# EAGLE design aspirin (EAGLE 6.1)
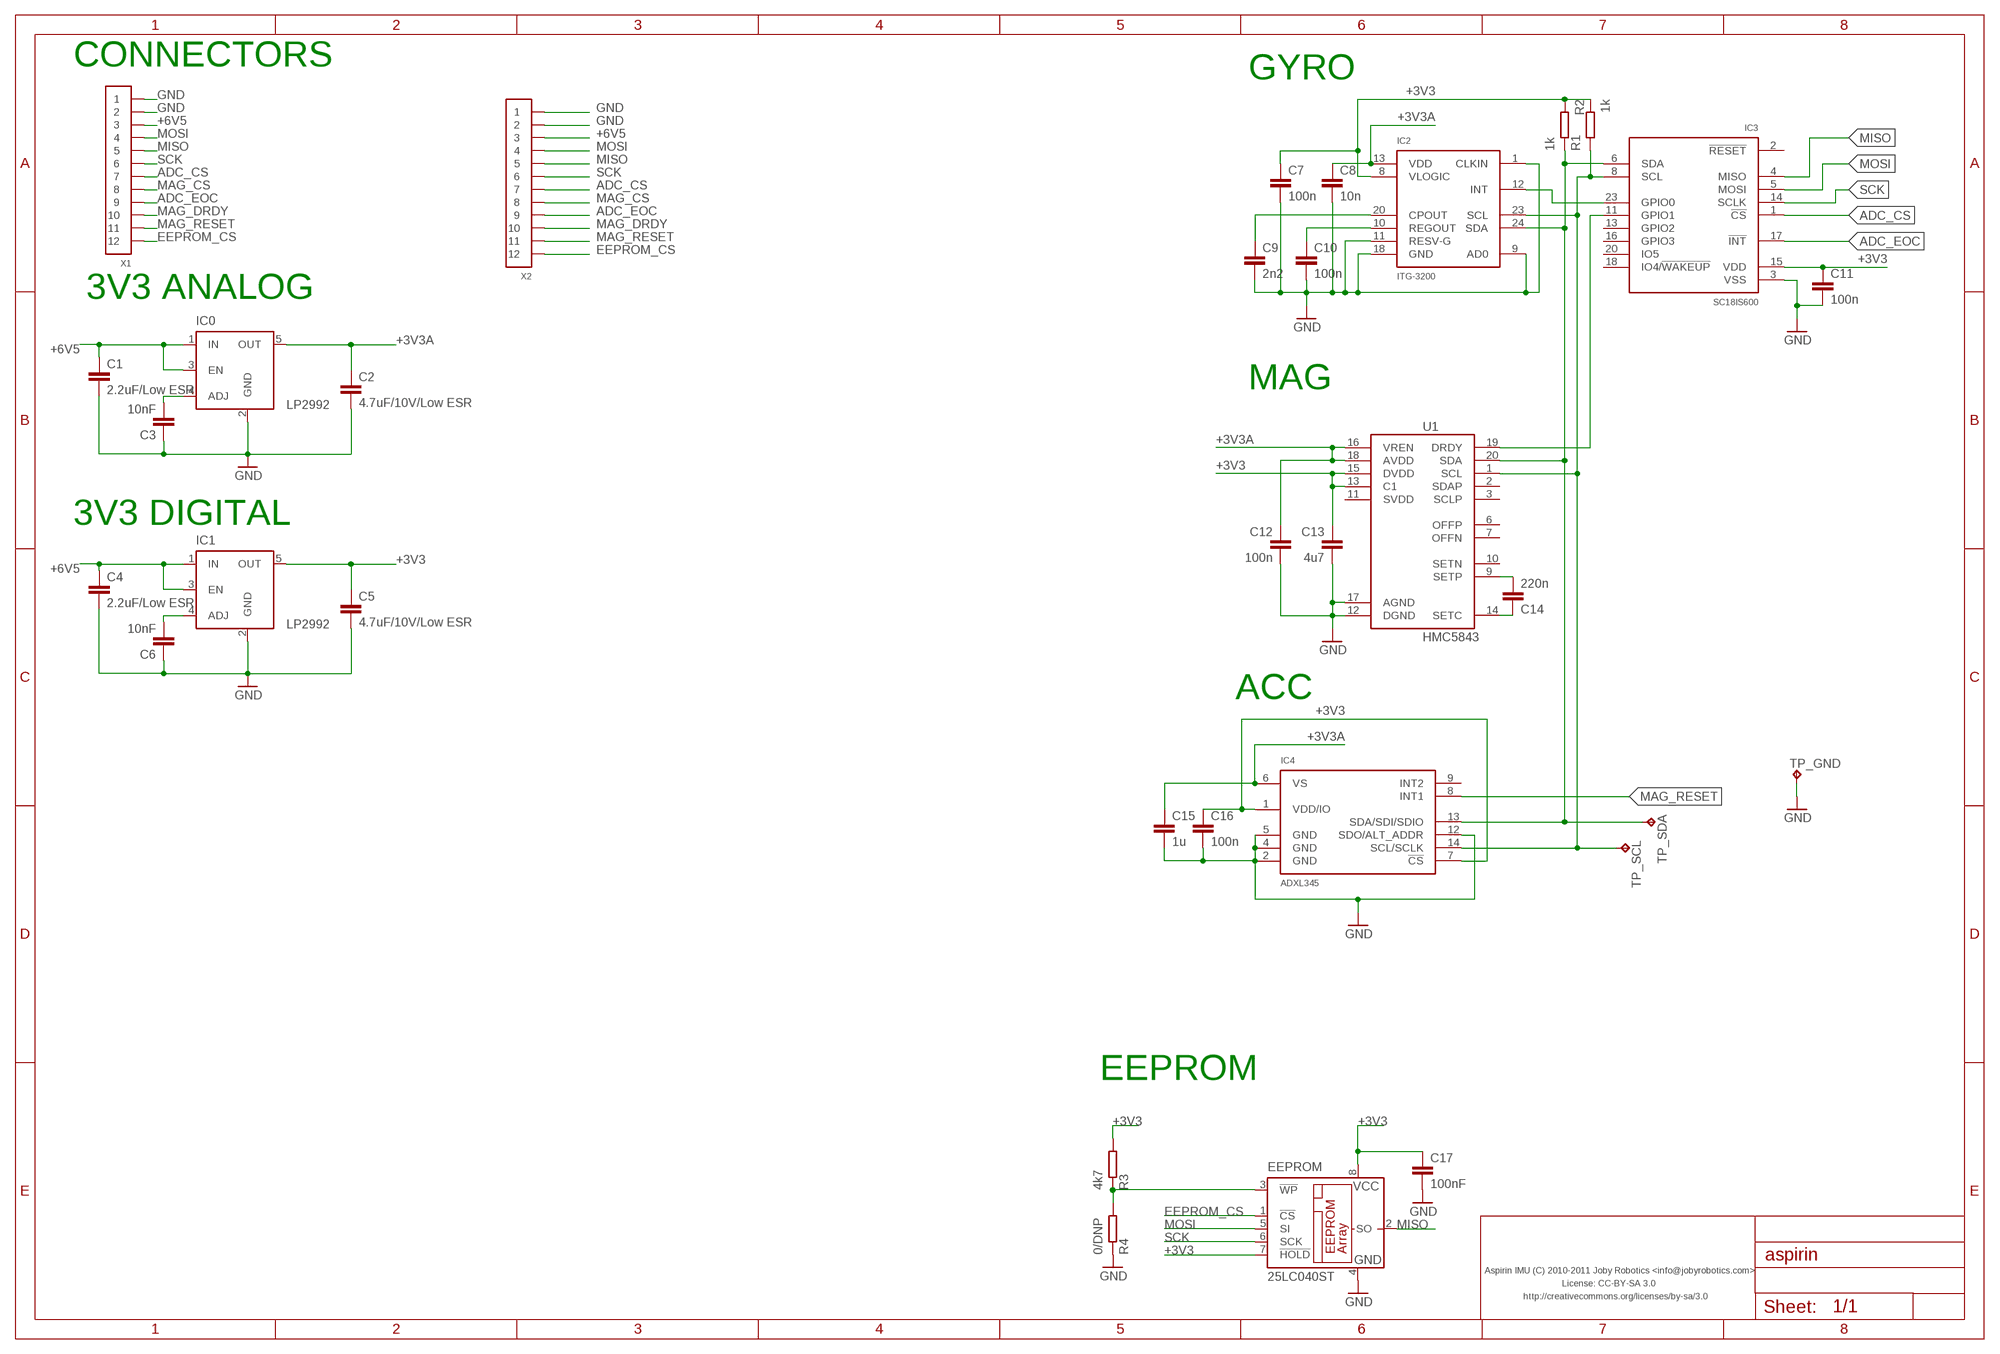
[diagram p0: schematic, sheet 1]

## Parts
C1  2.2uF/Low ESR  CAPACITOR-0603  [0603-CAP]
C2  4.7uF/10V/Low ESR  CAPACITOR-0603  [0603-CAP]
C3  10nF  CAPACITOR-0603  [0603-CAP]
C4  2.2uF/Low ESR  CAPACITOR-0603  [0603-CAP]
C5  4.7uF/10V/Low ESR  CAPACITOR-0603  [0603-CAP]
C6  10nF  CAPACITOR-0603  [0603-CAP]
C7  100n  CAPACITOR-0603  [0603-CAP]
C8  10n  CAPACITOR-0603  [0603-CAP]
C9  2n2  CAPACITOR-0603  [0603-CAP]
C10  100n  CAPACITOR-0603  [0603-CAP]
C11  100n  CAPACITOR-0603  [0603-CAP]
C12  100n  CAPACITOR-0603  [0603-CAP]
C13  4u7  CAPACITOR-0603  [0603-CAP]
C14  220n  CAPACITOR-0603  [0603-CAP]
C15  1u  CAPACITOR-0603  [0603-CAP]
C16  100n  CAPACITOR-0603  [0603-CAP]
C17  100nF  CAPACITOR-0603  [0603-CAP]
EEPROM  25LC040ST  [TSSOP8]
IC0  LP2992  MIC5219BM5  [SOT23-5]
IC1  LP2992  MIC5219BM5  [SOT23-5]
IC2  ITG-3200  ITG-3200-AX  [QFN24-WITH-AXES]
IC3  SC18IS600  [QFN24]
IC4  ADXL345  [LGA-14]
R1  1k  RESISTOR-0603  [0603-RES]
R2  1k  RESISTOR-0603  [0603-RES]
R3  4k7  RESISTOR-0603  [0603-RES]
R4  0/DNP  RESISTOR-0603  [0603-RES]
TP_GND  TP-SMD  [MINI_TESTPAD]
TP_SCL  TP-SMD  [MINI_TESTPAD]
TP_SDA  TP-SMD  [MINI_TESTPAD]
U1  HMC5843  [LPCC20-HMC5843]
X1  CONN_12-1-53047  [PB-53047-12]
X2  CONN_12-1-53261  [PB-53261-12]

## Nets
+3V3: C5.P$1 C7.P$1 C11.P$1 C13.P$1 C16.P$1 C17.P$1 EEPROM.7(!HOLD) EEPROM.8(VCC) IC1.5(OUT) IC2.8(VLOGIC) IC3.15(VDD) IC4.1(VDD/IO) IC4.7(!CS) R1.P$2 R2.P$1 R3.P$2 U1.13(C1) U1.15(DVDD)
+3V3A: C2.P$1 C8.P$1 C12.P$1 C15.P$1 IC0.5(OUT) IC2.13(VDD) IC4.6(VS) U1.16(VREN) U1.18(AVDD)
+6V5: C1.P$1 C4.P$1 IC0.1(IN) IC0.3(EN) IC1.1(IN) IC1.3(EN) X1.3 X2.3
ADC_CS: IC3.1(!CS) X1.7 X2.7
ADC_EOC: IC3.17(!INT) X1.9 X2.9
EEPROM_CS: EEPROM.1(!CS) X1.12 X2.12
GND: C1.P$2 C2.P$2 C3.P$1 C4.P$2 C5.P$2 C6.P$1 C7.P$2 C8.P$2 C9.P$2 C10.P$2 C11.P$2 C12.P$2 C13.P$2 C15.P$2 C16.P$2 C17.P$2 EEPROM.4(GND) IC0.2(GND) IC1.2(GND) IC2.1(CLKIN) IC2.9(AD0) IC2.11(RESV-G) IC2.18(GND) IC3.3(VSS) IC4.2(GND) IC4.4(GND) IC4.5(GND) IC4.12(SDO/ALT_ADDR) R4.P$1 TP_GND.1(TP) U1.12(DGND) U1.17(AGND) X1.1 X1.2 X2.1 X2.2
MAG_CS: IC2.12(INT) IC3.23(GPIO0) X1.8 X2.8
MAG_DRDY: IC3.11(GPIO1) U1.19(DRDY) X1.10 X2.10
MAG_RESET: IC4.8(INT1) X1.11 X2.11
MISO: EEPROM.2(SO) IC3.4(MISO) X1.5 X2.5
MOSI: EEPROM.5(SI) IC3.5(MOSI) X1.4 X2.4
N$1: C9.P$1 IC2.20(CPOUT)
N$2: C10.P$1 IC2.10(REGOUT)
N$19: C6.P$2 IC1.4(ADJ)
N$23: C3.P$2 IC0.4(ADJ)
N$34: C14.P$2 U1.9(SETP)
N$39: EEPROM.3(!WP) R3.P$1 R4.P$2
N$48: C14.P$1 U1.14(SETC)
SCK: EEPROM.6(SCK) IC3.14(SCLK) X1.6 X2.6
SCL: IC2.23(SCL) IC3.8(SCL) IC4.14(SCL/SCLK) R2.P$2 TP_SCL.1(TP) U1.1(SCL)
SDA: IC2.24(SDA) IC3.6(SDA) IC4.13(SDA/SDI/SDIO) R1.P$1 TP_SDA.1(TP) U1.20(SDA)
Unconnected: IC3.2(!RESET) IC3.13(GPIO2) IC3.16(GPIO3) IC3.18(IO4/!WAKEUP) IC3.20(IO5) IC4.9(INT2) U1.2(SDAP) U1.3(SCLP) U1.6(OFFP) U1.7(OFFN) U1.10(SETN) U1.11(SVDD)

## Notes on the sheet
- CONNECTORS
- GYRO
- 3V3 ANALOG
- MAG
- 3V3 DIGITAL
- ACC
- EEPROM
- Aspirin IMU (C) 2010-2011 Joby Robotics <info@jobyrobotics.com>
- License: CC-BY-SA 3.0
- http://creativecommons.org/licenses/by-sa/3.0

## Library data of the parts
C1-C17 = pel_dipol_comp:CAPACITOR
EEPROM = microchip:25*: Serial EEPROM 4 K, SPI bus
IC0 IC1 = v-reg-micrel:MIC5219BM5: VOLTAGE REGULATOR
IC2 = booz_imu:ITG-3200
IC3 = booz_imu:SC18IS600
IC4 = booz_imu:ADXL345
R1-R4 = pel_dipol_comp:RESISTOR
TP_GND TP_SCL TP_SDA = open-bldc:TP
U1 = omc:HMC5843: Honeywell HMC5843 - 3-Axis Digital Magnetometer - 3-Axis Magnetoresistive Sensors and ASIC in a Single Package - Low Voltage Operations (2.5 to 3.3V) - I2C Interface
X1 X2 = pel_molex:CONN_12-1

## Board
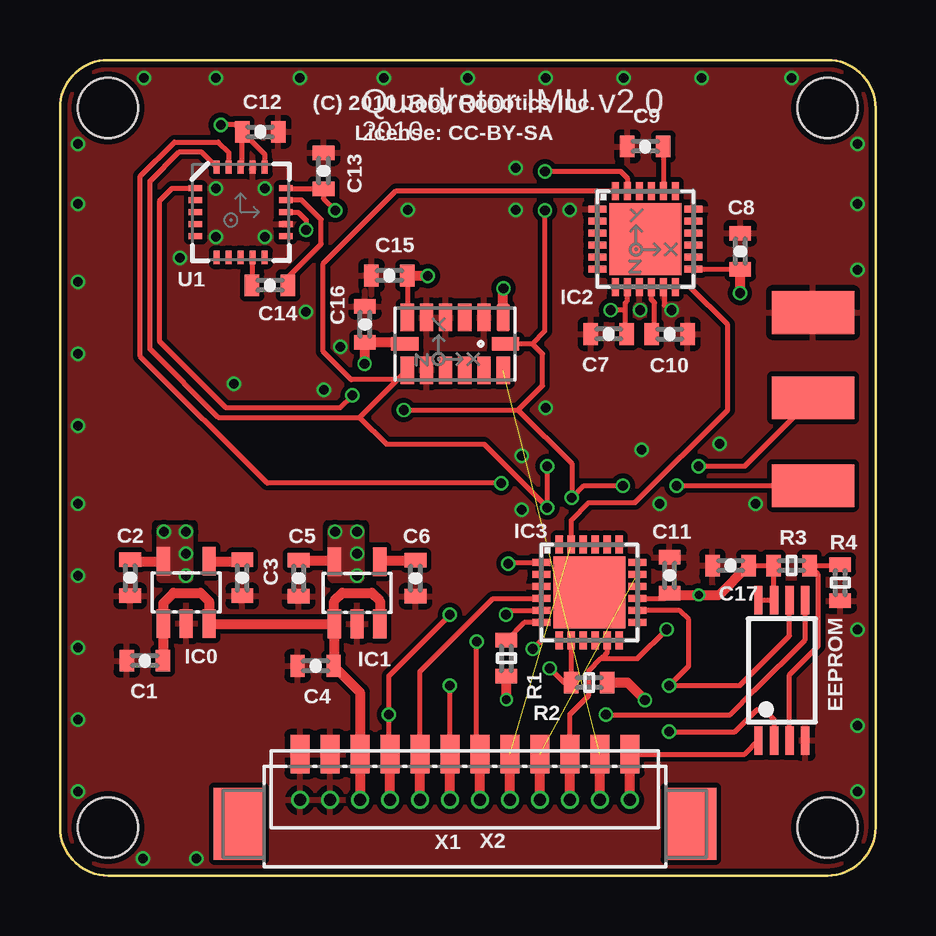
[diagram p1: board, top side]
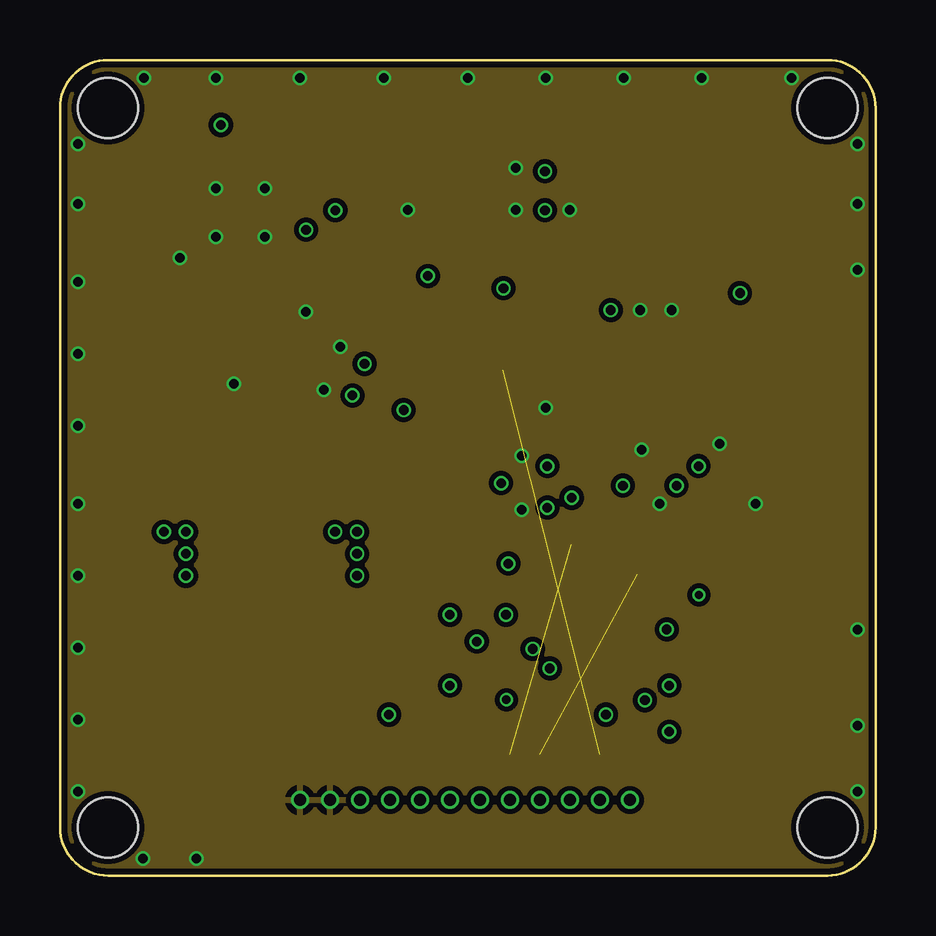
[diagram p2: board, inner layer Route2]
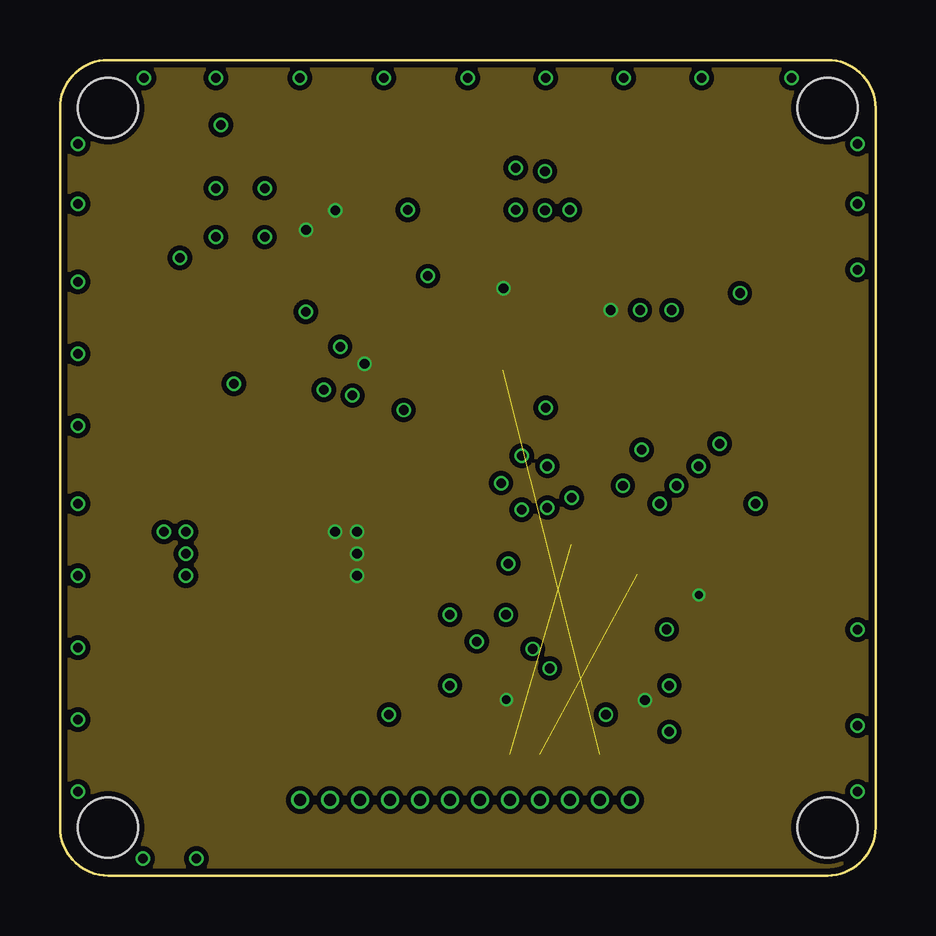
[diagram p3: board, inner layer Route15]
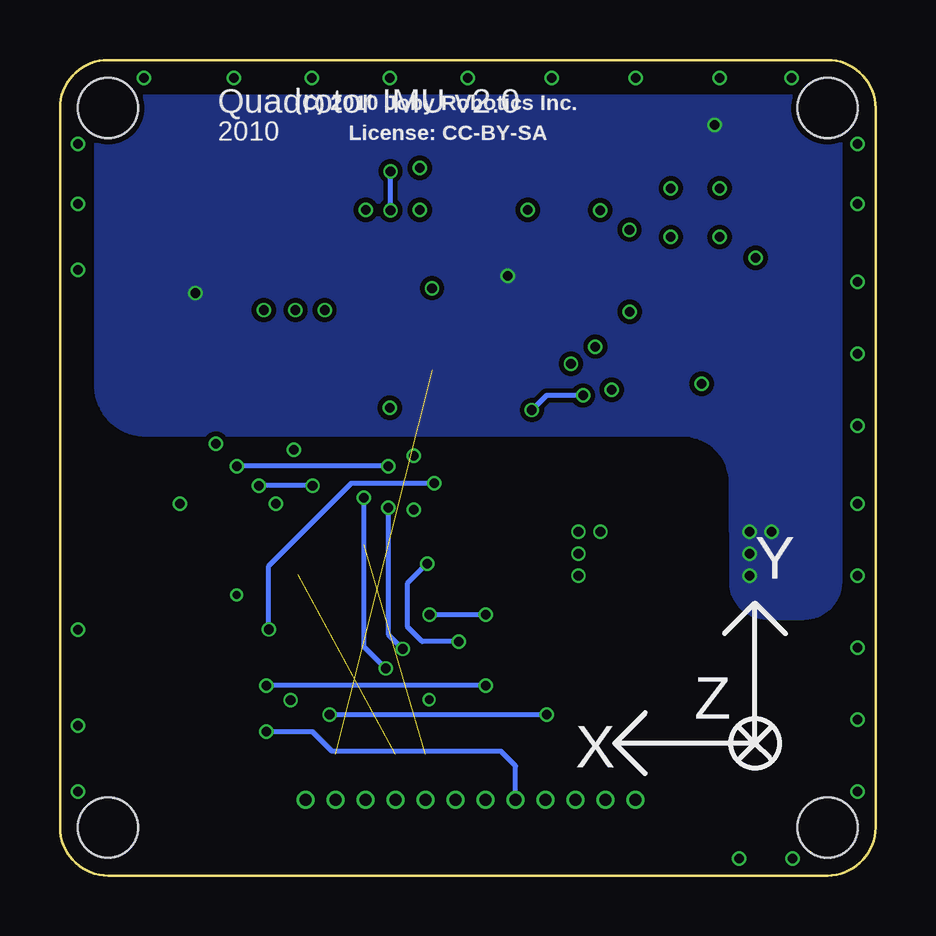
[diagram p4: board, bottom side, seen from below]

Size 34 x 34 mm. Coordinates in mm from the lower left corner, seen from the top.
Outline: 2,34 32,34 arc-90 34,32 34,2 arc-90 32,0 2,0 arc-90 0,2 0,32 arc-90 2,34
Copper layers (1*2+15*16): Top 0.035mm / dielectric 1.5mm / Route2 0.035mm / dielectric 0.15mm / Route15 0.035mm / dielectric 0.2mm / Bottom 0.035mm
Design rules: minimum track width 8mil, minimum drill 0.0102mm, track to track 8mil, track to pad 8mil, pad to pad 4mil, via to via 8mil, smd to smd 4mil, copper to edge 10mil, drill to drill 8mil, minimum pad ring 0.1mm, minimum via ring 0.1mm, stop-mask expansion 4mil, vias tented up to drill 0.4mm, thermal gap 10mil
Holes 2.5 mm at 2,32 32,32 32,2 2,2

### Footprints (pad centres in the part's own frame; a part is rotated, then mirrored left to right if it is on the bottom)
0603-CAP = smd 0.6 x 0.9: P$1 -0.75,0; P$2 0.75,0
TSSOP8 = smd 0.35 x 1.2: 1 -0.975,-2.925; 2 -0.325,-2.925; 3 0.325,-2.925; 4 0.975,-2.925; 5 0.975,2.925; 6 0.325,2.925; 7 -0.325,2.925; 8 -0.975,2.925
SOT23-5 = smd 0.55 x 1.2: 1 -0.95,-1.3; 2 0,-1.3; 3 0.95,-1.3; 4 0.95,1.3; 5 -0.95,1.3
QFN24-WITH-AXES = smd 0.75 x 0.3: 1 -2,1.25; 2 -2,0.75; 3 -2,0.25; 4 -2,-0.25; 5 -2,-0.75; 6 -2,-1.25; 13 2,-1.25; 14 2,-0.75; 15 2,-0.25; 16 2,0.25; 17 2,0.75; 18 2,1.25 | smd 0.3 x 0.75: 7 -1.25,-2; 8 -0.75,-2; 9 -0.25,-2; 10 0.25,-2; 11 0.75,-2; 12 1.25,-2; 19 1.25,2; 20 0.75,2; 21 0.25,2; 22 -0.25,2; 23 -0.75,2; 24 -1.25,2 | smd 3 x 3: EXP 0,0
QFN24 = smd 0.75 x 0.3: 1 -2,1.25; 2 -2,0.75; 3 -2,0.25; 4 -2,-0.25; 5 -2,-0.75; 6 -2,-1.25; 13 2,-1.25; 14 2,-0.75; 15 2,-0.25; 16 2,0.25; 17 2,0.75; 18 2,1.25 | smd 0.3 x 0.75: 7 -1.25,-2; 8 -0.75,-2; 9 -0.25,-2; 10 0.25,-2; 11 0.75,-2; 12 1.25,-2; 19 1.25,2; 20 0.75,2; 21 0.25,2; 22 -0.25,2; 23 -0.75,2; 24 -1.25,2 | smd 3 x 3: EXP 0,0
LGA-14 = smd 1.145 x 0.55: 1 -1.097,2; 2 -1.097,1.2; 3 -1.097,0.4; 4 -1.097,-0.4; 5 -1.097,-1.2; 6 -1.097,-2; 8 1.097,2; 9 1.097,1.2; 10 1.097,0.4; 11 1.097,-0.4; 12 1.097,-1.2; 13 1.097,-2 | smd 0.55 x 1.145: 7 0,-2.098; 14 0,2.098
0603-RES = smd 0.6 x 0.9: P$1 -0.75,0; P$2 0.75,0
MINI_TESTPAD = smd 3.429 x 1.778: 1 0,0
LPCC20-HMC5843 = smd 0.25 x 0.56: 1 1,1.88; 2 0.5,1.88; 3 0,1.88; 4 -0.5,1.88; 5 -1,1.88; 11 -1,-1.88; 12 -0.5,-1.88; 13 0,-1.88; 14 0.5,-1.88; 15 1,-1.88 | smd 0.56 x 0.25: 6 -1.88,1; 7 -1.88,0.5; 8 -1.88,0; 9 -1.88,-0.5; 10 -1.88,-1; 16 1.88,-1; 17 1.88,-0.5; 18 1.88,0; 19 1.88,0.5; 20 1.88,1
PB-53047-12 = drill 0.5: 1 -6.875,0; 2 -5.625,0; 3 -4.375,0; 4 -3.125,0; 5 -1.875,0; 6 -0.625,0; 7 0.625,0; 8 1.875,0; 9 3.125,0; 10 4.375,0; 11 5.625,0; 12 6.875,0
PB-53261-12 = smd 0.8 x 1.6: 1 -6.875,1.1; 2 -5.625,1.1; 3 -4.375,1.1; 4 -3.125,1.1; 5 -1.875,1.1; 6 -0.625,1.1; 7 0.625,1.1; 8 1.875,1.1; 9 3.125,1.1; 10 4.375,1.1; 11 5.625,1.1; 12 6.875,1.1 | smd 2.1 x 3: MNT1 -9.425,-1.8; MNT2 9.425,-1.8

### Placement (x,y rotation side)
C1  3.54,8.96 180 top
C2  2.93,12.41 270 top
C3  7.6,12.41 90 top
C4  10.66,8.74 180 top
C5  9.95,12.4 270 top
C6  14.82,12.4 90 top
C7  22.88,22.57 180 top
C8  28.36,26.03 90 top
C9  24.4,30.39 180 top
C10  25.42,22.57 0 top
C11  25.42,12.51 90 top
C12  8.35,31 0 top
C13  10.99,29.38 90 top
C14  8.75,24.6 180 top
C15  13.73,25.01 180 top
C16  12.72,22.98 90 top
C17  27.96,12.92 180 top
EEPROM  30.09,8.55 0 top
IC0  5.26,11.8 0 top
IC1  12.38,11.79 0 top
IC2  24.4,26.53 0 top
IC3  22.06,11.8 0 top
IC4  16.48,22.16 270 top
R1  18.61,9.06 270 top
R2  22.06,8.04 180 top
R3  30.5,12.92 180 top
R4  32.53,12.21 90 top
TP_GND  31.39,23.47 0 top
TP_SCL  31.39,16.26 180 top
TP_SDA  31.39,19.91 0 top
U1  7.53,27.65 90 top
X1  16.88,3.15 0 top
X2  16.88,3.96 0 top

### Tracks (layer width: path | path; a pad name or v marks a point on that pad's centre or on a via)
+3V3  (via drill 0.35, 0.4)
  Top 0.203: U1.15 9.44,28.63 C13.P$1 10.99,28.23 v11.48,27.74 | C17.P$1 R3.P$2 29.75,11.49 EEPROM.7 EEPROM.8 | C11.P$1 25.2,11.55 IC3.15 | IC2.8 23.65,23.95 23.57,23.88 23.57,23.57 | 23.57,23.57 23.57,22.63 C7.P$1 | 23.57,23.57 v22.96,23.57 | U1.13 9.94,27.65 9.96,27.64 10.26,27.33 v10.26,26.92
  Top 0.406: v18.61,7.33 R1.P$2 | IC4.7 14.31,22.23 C16.P$1 12.7,22.21 v12.7,21.34 | IC1.5 11.38,13.14 C5.P$1 | C11.P$1 25.48,11.7 v26.64,11.7 27.49,11.7 C17.P$1 | R2.P$1 23.66,8.04 v24.38,7.32 | IC4.1 18.48,24.47 v18.49,24.49
  other vias: 11.47,14.33 12.38,14.33 12.38,13.41 12.38,12.5
  pour Route15: 0,0 33.97,0 33.97,33.97 0,33.97
  pour Top (no thermals): 12.49,12.4 11.37,12.4 11.37,14.43 12.49,14.43
+3V3A  (via drill 0.4)
  Top 0.203: IC2.13 C8.P$1 | C12.P$1 7.6,29.59 U1.18 | U1.16 8.53,30.07 C12.P$1 | C15.P$1 IC4.6 | C2.P$1 2.99,13.1 | v6.71,31.29 7.31,31.29 C12.P$1
  Top 0.406: 2.99,13.1 IC0.5 | C15.P$1 15.33,25.01 v15.34,24.99 | v28.35,24.28 28.35,25.26 C8.P$1
  other vias: 4.33,14.33 5.25,14.33 5.25,13.41 5.25,12.5
  pour Bottom: 3,10.75 4.5,10.75 arc90 6,12.25 6.01,16.36 arc-90 8.04,18.39 30.55,18.39 arc90 32.47,20.56 32.47,32.47 1.5,32.47 1.5,12.5 1.5,12.25 arc90
  pour Top (no thermals): 5.35,12.4 4.23,12.4 4.23,14.43 5.35,14.43
+6V5
  Top 0.406: X1.3 X2.3 12.51,7.64 C4.P$1 11.44,8.77 IC1.1 | C1.P$1 4.31,8.98 IC0.1 | IC0.1 4.31,11.36 4.74,11.79 5.86,11.79 6.21,11.43 IC0.3 6.23,10.49 IC1.1 | IC1.1 11.44,11.45 11.78,11.79 12.99,11.79 13.34,11.45 IC1.3 | IC0.1 4.3,10.49
ADC_CS  (via drill 0.4)
  Top 0.203: X2.7 17.37,5.2 v17.37,9.75 | v18.69,13.01 18.74,13.05 IC3.1
  Top 0.406: X1.7 X2.7
  Bottom 0.203: v17.37,9.75 18.9,9.75 19.51,10.36 19.51,12.19 v18.69,13.01
ADC_EOC  (1 unrouted)
  Top 0.406: X1.9 X2.9
EEPROM_CS
  Top 0.203: X2.12 28.55,5.06 EEPROM.1
  Top 0.406: X1.12 X2.12
GND  (via drill 0.4)
  Top 0.203: 25.2,23.77 25.2,24.49 IC2.11
  other vias: 24.18,23.57 11.68,22.05 6.5,26.62 8.53,26.62 8.53,28.65 6.5,28.65 25.5,23.57 3.45,0.71 5.69,0.71 0.75,3.5 0.75,6.5 0.75,9.5 0.75,12.5 0.75,15.5 0.75,18.75 0.75,21.75 0.75,24.75 0.75,28 0.75,30.5 3.5,33.25 6.5,33.25 10,33.25 13.5,33.25 17,33.25 20.25,33.25 23.5,33.25 26.75,33.25 30.5,33.25 33.25,30.5 33.25,28 33.25,25.25 19.25,17.5 24.25,17.75 20.25,19.5 21.25,27.75 14.5,27.75 19,27.75 33.25,3.5 33.25,6.25 33.25,10.25 25,15.5 29,15.5 27.5,18 19,29.5 10.25,23.5 11,20.25 7.25,20.5 5,25.75 19.25,15.25
  pour Top (rank 6): 0,0 33.97,0 33.97,33.97 0,33.97
  pour Route2: 0,0 33.97,0 33.97,33.97 0,33.97
MAG_CS  (1 unrouted)
  Top 0.203: IC2.12 26.27,24.53 27.84,22.96 27.84,19.41 23.98,15.54 22.05,15.54 21.31,14.81 IC3.23
  Top 0.406: X1.8 X2.8
MAG_DRDY  (via drill 0.4)
  Top 0.203: X2.10 21.26,6.73 22.05,7.52 22.05,8.53 22.55,9.04 | 22.55,9.04 22.76,9.25 22.81,9.3 IC3.11 | U1.19 7.03,30.15 6.6,30.58 4.78,30.58 3.35,29.16 3.35,21.64 8.64,16.36 v18.39,16.36 | v25.3,10.26 24.08,9.04 22.55,9.04
  Top 0.406: X1.10 X2.10
  Bottom 0.203: v18.39,16.36 21.84,16.36 25.3,12.9 v25.3,10.26
MAG_RESET  (1 unrouted)
  Top 0.406: X1.11 X2.11
MISO  (via drill 0.4)
  Top 0.203: X2.5 15.01,8.5 17.98,11.48 18.05,11.55 IC3.4 | EEPROM.2 29.77,6.51 29.36,6.91 29.06,6.91 28.14,5.99 v25.4,5.99
  Top 0.406: X1.5 X2.5
  Bottom 0.203: v25.4,5.99 23.47,5.99 22.66,5.18 15.62,5.18 15.01,4.57 X1.5
MOSI  (via drill 0.4)
  Top 0.203: v18.59,10.87 18.77,11.05 IC3.5 | EEPROM.5 31.07,9.83 28.96,7.72 27.94,6.71 v22.76,6.71 | X2.4 13.72,5.1 v13.72,6.71 13.72,8.33 v16.26,10.87
  Top 0.406: X1.4 X2.4
  Bottom 0.203: v16.26,10.87 v18.59,10.87 | v13.72,6.71 v22.76,6.71
N$1
  Top 0.203: C9.P$1 IC2.20
N$2
  Top 0.203: IC2.10 24.65,24.02 24.79,23.88 24.79,22.7 C10.P$1
N$19
  Top 0.406: IC1.4 13.39,13.14 C6.P$2
N$23
  Top 0.203: 7.54,13.1 C3.P$2
  Top 0.406: IC0.4 7.54,13.1
N$34
  Top 0.203: U1.9 8.03,24.63 C14.P$2
N$39
  Top 0.203: R4.P$2 32.49,12.92 R3.P$1 31.61,12.55 31.61,9.57 30.41,8.37 EEPROM.3
N$48
  Top 0.203: C14.P$1 9.5,24.95 10.89,26.33 10.89,27.35 10.07,28.16 9.42,28.16 U1.14
SCK  (via drill 0.4)
  Top 0.203: X2.6 v16.26,7.92 | IC3.14 25.83,11.05 26.21,10.67 26.21,8.74 v25.4,7.92 28.35,7.92 30.41,9.99 EEPROM.6
  Top 0.406: X1.6 X2.6
  Bottom 0.203: v16.26,7.92 v25.4,7.92
SCL  (via drill 0.4)
  Top 0.203: IC3.8 21.31,9.05 R2.P$2 21.02,8.04 v20.42,8.64 | U1.1 4.67,28.65 4.17,28.14 4.17,22.25 6.91,19.51 11.68,19.51 v12.19,20.02 | v14.33,19.41 19.1,19.41 | 19.1,19.41 20.12,20.42 20.12,21.74 19.69,22.16 | 19.69,22.16 IC4.14 | 19.69,22.16 20.22,22.69 v20.22,27.74 | v20.22,29.36 23.37,29.36 23.65,29.08 IC2.23 | 19.1,19.41 21.34,17.17 v21.34,15.75 21.84,16.26 v23.47,16.26 | v25.7,16.26 TP_SCL.1
  Bottom 0.203: v12.19,20.02 13.72,20.02 v14.33,19.41 | v20.22,27.74 v20.22,29.36 | v20.42,8.64 21.34,9.55 v21.34,15.75 | v23.47,16.26 v25.7,16.26
SDA  (via drill 0.4)
  Top 0.203: R1.P$1 19.35,10.55 IC3.6 20.06,9.8 v19.71,9.45 | U1.20 5.89,30.18 4.98,30.18 3.76,28.96 3.76,21.95 6.6,19.1 12.5,19.1 | 12.5,19.1 14.07,20.68 | 14.07,20.68 14.46,21.07 IC4.13 | IC2.24 23.13,28.55 14.02,28.55 10.97,25.5 10.97,21.84 12.14,20.68 14.07,20.68 | 12.5,19.1 13.61,17.98 17.68,17.98 v20.32,15.34 v20.32,17.07 | TP_SDA.1 28.55,17.07 v26.62,17.07
  Bottom 0.203: v19.71,9.45 20.32,10.06 v20.32,15.34 | v20.32,17.07 v26.62,17.07

### Text on the board
tPlace: (C) 2010 Joby Robotics Inc. | License: CC-BY-SA
bPlace: (C) 2010 Joby Robotics Inc. | License: CC-BY-SA
tNames: Quadrotor IMU v2.0 | 2010
bNames: Quadrotor IMU v2.0 | 2010 | Y | Z | X